# EAGLE design resistive_splitter (EAGLE 9.2.2)
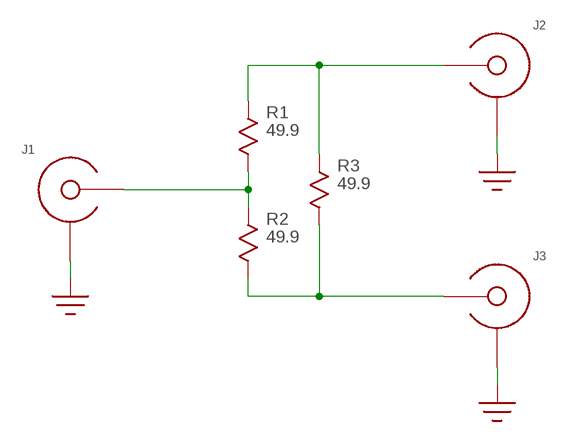
[diagram p0: schematic, sheet 1]

## Parts
J1  EDGE_LAUNCH_JACKNARROW  [EDGE_LAUNCH_RF_CON_NARROW]
J2  EDGE_LAUNCH_JACKNARROW  [EDGE_LAUNCH_RF_CON_NARROW]
J3  EDGE_LAUNCH_JACKNARROW  [EDGE_LAUNCH_RF_CON_NARROW]
R1  49.9  R0603  [R0603]
R2  49.9  R0603  [R0603]
R3  49.9  R0603  [R0603]

## Nets
GND: J1.GND@1(SHIELD) J1.GND@2(SHIELD) J1.GND@3(SHIELD) J1.GND@4(SHIELD) J1.GND@5(SHIELD) J1.GND@6(SHIELD) J1.SHIELD@1(SHIELD) J1.SHIELD@2(SHIELD) J2.GND@1(SHIELD) J2.GND@2(SHIELD) J2.GND@3(SHIELD) J2.GND@4(SHIELD) J2.GND@5(SHIELD) J2.GND@6(SHIELD) J2.SHIELD@1(SHIELD) J2.SHIELD@2(SHIELD) J3.GND@1(SHIELD) J3.GND@2(SHIELD) J3.GND@3(SHIELD) J3.GND@4(SHIELD) J3.GND@5(SHIELD) J3.GND@6(SHIELD) J3.SHIELD@1(SHIELD) J3.SHIELD@2(SHIELD)
N$1: J1.CENTER R1.P$2 R2.P$1
N$2: J2.CENTER R1.P$1 R3.P$1
N$3: J3.CENTER R2.P$2 R3.P$2

## Library data of the parts
J1-J3 = yapo:EDGE_LAUNCH_JACK
R1-R3 = yapo:R

## Board
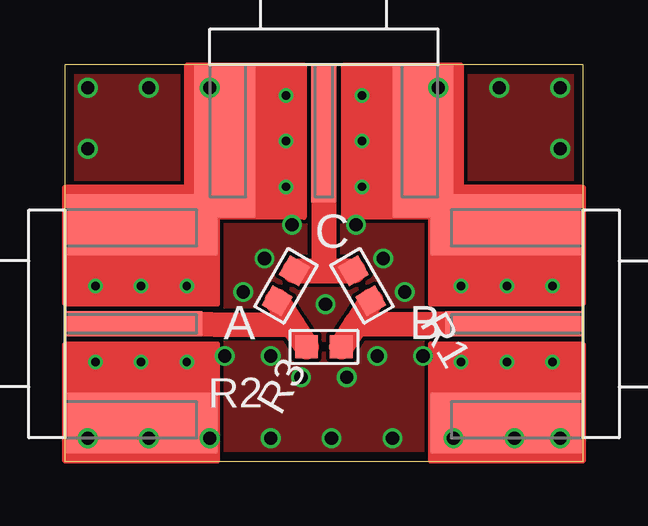
[diagram p1: board, top side]
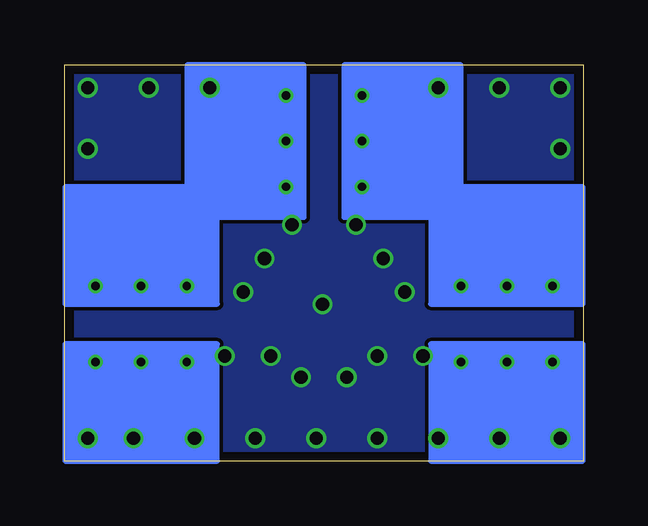
[diagram p2: board, bottom side, seen from below]

Size 21.59 x 16.51 mm. Coordinates in mm from the lower left corner, seen from the top.
Outline: 0,0 21.59,0 21.59,16.51 0,16.51 0,0
Copper layers (1*16): Top 0.035559375mm / dielectric 1.6mm / Bottom 0.035559375mm
Design rules "oshpark-2layer *": minimum track width 6mil, minimum drill 10mil, track to track 6mil, track to pad 6mil, pad to pad 6mil, via to via 6mil, smd to smd 6mil, copper to edge 15mil, drill to drill 6mil, minimum pad ring 5mil, minimum via ring 5mil, stop-mask expansion 2.5mil, vias tented up to drill 30mil, thermal gap 10mil

### Footprints (pad centres in the part's own frame; a part is rotated, then mirrored left to right if it is on the bottom)
EDGE_LAUNCH_RF_CON_NARROW = smd 5.715 x 1.041: CENTER -2.875,0 | drill 0.35: GND@1 -5.08,1.587; GND@2 -3.175,1.587; GND@3 -1.27,1.587; GND@4 -5.08,-1.587; GND@5 -3.175,-1.587; GND@6 -1.27,-1.587 | smd 6.35 x 2.54: SHIELD@1 -3.175,-4.128; SHIELD@2 -3.175,4.128
R0603 = smd 0.95 x 0.95: P$1 -0.725,0; P$2 0.725,0

### Placement (x,y rotation side)
J1  21.59,5.71 0 top
J2  10.79,16.51 90 top
J3  0,5.71 180 top
R1  12.38,7.3 300 top
R2  10.79,4.76 180 top
R3  9.21,7.3 240 top

### Tracks (layer width: path | path; a pad name or v marks a point on that pad's centre or on a via)
GND  (via drill 0.55)
  other vias: 0.95,0.95 3.49,0.95 6.03,0.95 8.57,0.95 11.11,0.95 13.65,0.95 16.19,0.95 18.73,0.95 20.64,0.95 0.95,15.56 3.49,15.56 6.03,15.56 20.64,15.56 18.1,15.56 15.56,15.56 0.95,13.02 20.64,13.02 9.46,9.84 12.13,9.84 8.32,8.45 7.43,7.05 13.27,8.45 14.16,7.05 9.84,3.49 11.75,3.49 13.02,4.38 14.92,4.38 8.57,4.38 6.67,4.38 10.86,6.54
  pour Top (no thermals): 0,0 21.59,0 21.59,16.51 0,16.51
  pour Bottom: 0,0 21.59,0 21.59,16.51 0,16.51
N$1
  Top 1.041: R1.P$2 12.11,5.68 | 12.11,5.68 R2.P$1 | J1.CENTER 12.11,5.68
N$2
  Top 1.041: R3.P$1 10.79,7.93 | 10.79,7.93 R1.P$1 | J2.CENTER 10.79,7.93
N$3
  Top 1.041: R3.P$2 9.48,5.68 | 9.48,5.68 R2.P$2 | J3.CENTER 9.48,5.68

### Text on the board
tPlace: C | A | B